# Altium schematic sheet Sheet4_SFP_StepperDriver.SchDoc: Koruza Expander Board
size A4; Date: 12.7.2016; Author: Matej Gomboc; CompanyName: Institute IRNAS Rače; Revision: 1.0; SheetNumber: 4; SheetTotal: 4; CurrentDate: 12.7.2016
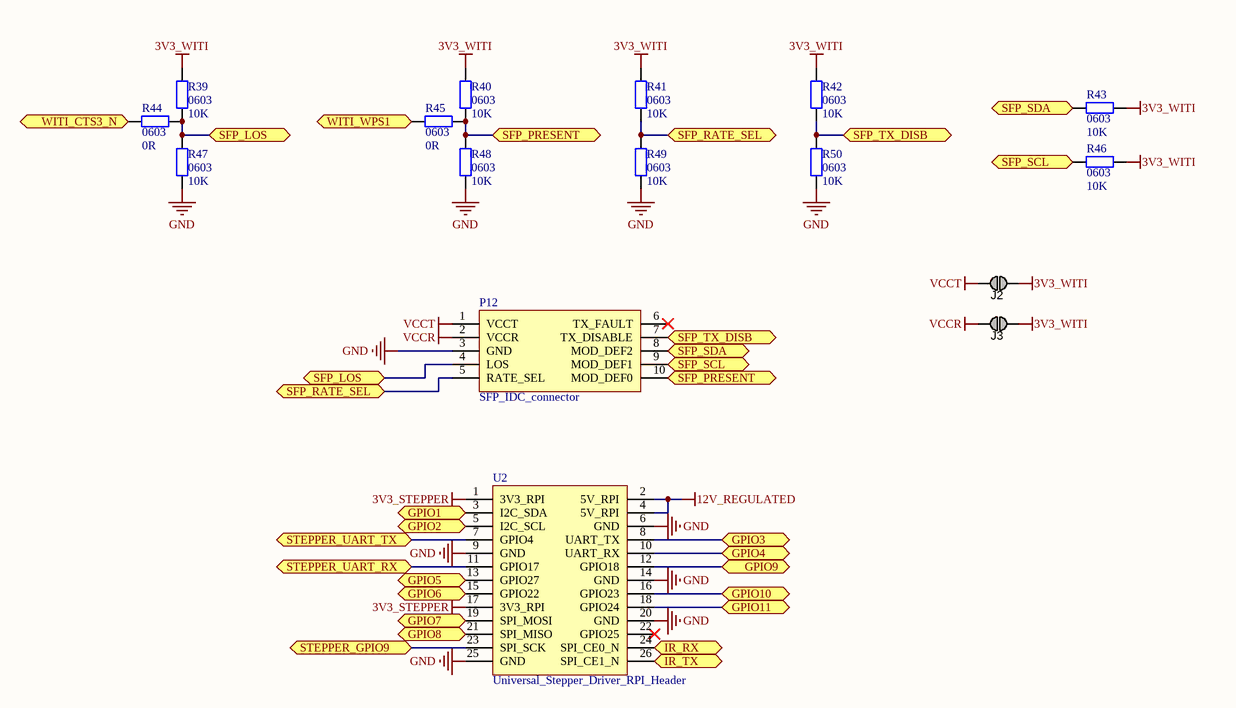
[diagram p0: Sheet4_SFP_StepperDriver.SchDoc]

## Parts
J2  Jumper  [JUMP1]  (value not drawn)  (no BOM)
J3  Jumper  [JUMP1]  (value not drawn)  (no BOM)
P12  SFP_IDC_connector  [IDC10]
R39  0603  value 10K  [0603_HandSoldering]
R40  0603  value 10K  [0603_HandSoldering]
R41  0603  value 10K  [0603_HandSoldering]
R42  0603  value 10K  [0603_HandSoldering]
R43  0603  value 10K  [0603_HandSoldering]
R44  0603  value 0R  [0603_HandSoldering]
R45  0603  value 0R  [0603_HandSoldering]
R46  0603  value 10K  [0603_HandSoldering]
R47  0603  value 10K  [0603_HandSoldering]
R48  0603  value 10K  [0603_HandSoldering]
R49  0603  value 10K  [0603_HandSoldering]
R50  0603  value 10K  [0603_HandSoldering]
U2  Universal_Stepper_Driver_RPI_Header  [Universal_Stepper_Driver_board]

## Ports
GPIO1, GPIO2, GPIO3, GPIO4, GPIO5, GPIO6, GPIO7, GPIO8, GPIO9, GPIO10, GPIO11, IR_RX, IR_TX, SFP_LOS, SFP_PRESENT, SFP_RATE_SEL, SFP_SCL, SFP_SDA, SFP_TX_DISB, STEPPER_GPIO9, STEPPER_UART_RX, STEPPER_UART_TX, WITI_CTS3_N, WITI_WPS1

## Nets
3V3_STEPPER: U2.1(3V3_RPI) U2.17(3V3_RPI)
3V3_WITI: J2.1 J3.2 R39.2 R40.2 R41.2 R42.2 R43.1 R46.1
12V_REGULATED: U2.2(5V_RPI) U2.4(5V_RPI)
GND: P12.3(GND) R47.1 R48.1 R49.1 R50.1 U2.6(GND) U2.9(GND) U2.14(GND) U2.20(GND) U2.25(GND)
VCCR: J3.1 P12.2(VCCR)
VCCT: J2.2 P12.1(VCCT)
GPIO1: U2.3(I2C_SDA) ; port GPIO1
GPIO2: U2.5(I2C_SCL) ; port GPIO2
GPIO3: U2.8(UART_TX) ; port GPIO3
GPIO4: U2.10(UART_RX) ; port GPIO4
GPIO5: U2.13(GPIO27) ; port GPIO5
GPIO6: U2.15(GPIO22) ; port GPIO6
GPIO7: U2.19(SPI_MOSI) ; port GPIO7
GPIO8: U2.21(SPI_MISO) ; port GPIO8
GPIO9: U2.12(GPIO18) ; port GPIO9
GPIO10: U2.16(GPIO23) ; port GPIO10
GPIO11: U2.18(GPIO24) ; port GPIO11
IR_RX: U2.24(SPI_CE0_N) ; port IR_RX
IR_TX: U2.26(SPI_CE1_N) ; port IR_TX
SFP_LOS: P12.4(LOS) R39.1 R44.2 R47.2 ; port SFP_LOS
SFP_PRESENT: P12.10(MOD_DEF0) R40.1 R45.2 R48.2 ; port SFP_PRESENT
SFP_RATE_SEL: P12.5(RATE_SEL) R41.1 R49.2 ; port SFP_RATE_SEL
SFP_SCL: P12.9(MOD_DEF1) R46.2 ; port SFP_SCL
SFP_SDA: P12.8(MOD_DEF2) R43.2 ; port SFP_SDA
SFP_TX_DISB: P12.7(TX_DISABLE) R42.1 R50.2 ; port SFP_TX_DISB
STEPPER_GPIO9: U2.23(SPI_SCK) ; port STEPPER_GPIO9
STEPPER_UART_RX: U2.11(GPIO17) ; port STEPPER_UART_RX
STEPPER_UART_TX: U2.7(GPIO4) ; port STEPPER_UART_TX
WITI_CTS3_N: R44.1 ; port WITI_CTS3_N
WITI_WPS1: R45.1 ; port WITI_WPS1

Not connected (* = marked no-connect by the designer): P12 6(TX_FAULT)*; U2 22(GPIO25)*

## Library data of the parts
J2 J3 = JUMP1: SMD jumper
P12 = SFP_IDC_connector: SFP IDC10 connector
R39-R50 = resistor
U2 = Universal_Stepper_Driver: Universal Stepper Driver Raspberry PI Header